# Altium schematic sheet Schematic.SchDoc
size A
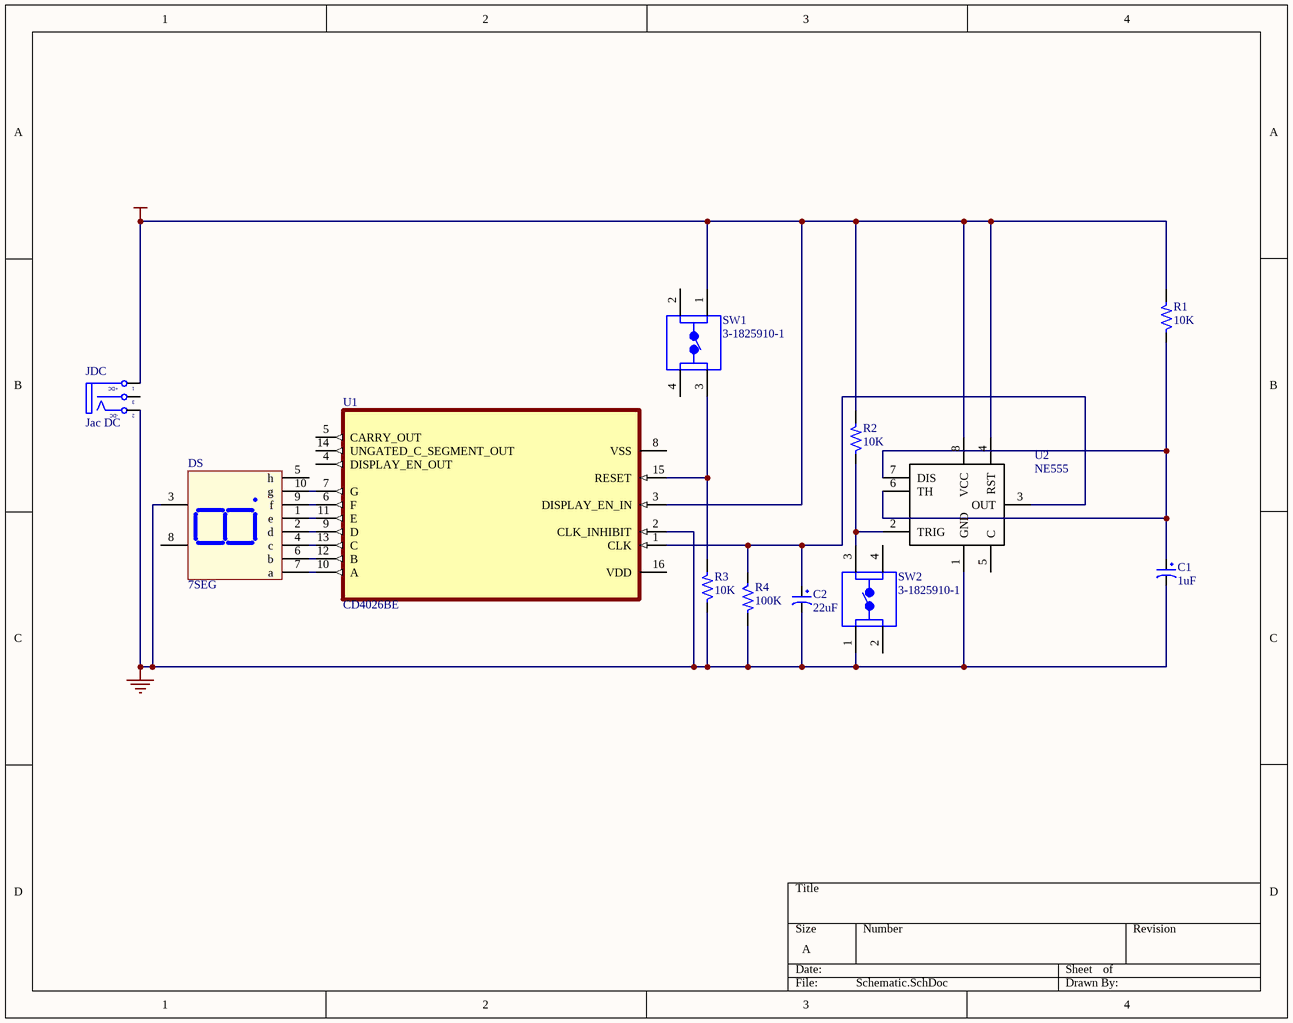
[diagram p0: Schematic.SchDoc]

## Parts
C1  1uF  [CP1/2]
C2  22uF  [CP1/2]
DS  7SEG  [LED7SEG-1-0.56]
JDC  Jac DC  [DC0]
R1  10K  [R1/4W]
R2  10K  [R1/4W]
R3  10K  [R1/4W]
R4  100K  [R1/4W]
SW1  3-1825910-1  [TE_3-1825910-1]
SW2  3-1825910-1  [TE_3-1825910-1]
U1  CD4026BE  [DIP254P762X508-16]
U2  NE555  [DIP8]

## Nets
+5: JDC.1(T) R1.2 R2.2 SW1.1 U1.3(DISPLAY_EN_IN) U2.4(RST) U2.8(VCC)
GND: C1.2 C2.2 DS.3(Vcc) JDC.2(TN) R3.1 R4.2 SW2.1 U1.2(CLK_INHIBIT) U2.1(GND)
NetC1_1: C1.1 R1.1 U2.6(TH) U2.7(DIS)
NetC2_1: C2.1 R4.1 U1.1(CLK) U2.3(OUT)
NetDS_1: DS.1(e) U1.11(E)
NetDS_2: DS.2(d) U1.9(D)
NetDS_4: DS.4(c) U1.13(C)
NetDS_6: DS.6(b) U1.12(B)
NetDS_7: DS.7(a) U1.10(A)
NetDS_9: DS.9(f) U1.6(F)
NetDS_10: DS.10(g) U1.7(G)
NetR2_1: R2.1 SW2.3 U2.2(TRIG)
NetR3_2: R3.2 SW1.3 U1.15(RESET)

Not connected (* = marked no-connect by the designer): DS 5(h) 8(Vcc); JDC 3(S); SW1 2 4; SW2 2 4; U1 4(DISPLAY_EN_OUT) 5(CARRY_OUT) 8(VSS) 14(UNGATED_C_SEGMENT_OUT) 16(VDD); U2 5(C)

## Notes on the sheet
- (in symbol DCIN) +DC; -DC

## Library data of the parts
C1 C2 = CP1: Cap P  0,1uF < 22uF , 16 - 50V; Value: 10uF/50V; Description 1: 10 => 220uF/6,3V/10V - 10uF => 100uF/16V; Description 2: 0,1uF => 33uF/50V - 10uF => 22uF/63V; Description 3: 0,47uF => 10uF/100V
DS = LED7SEG-1: 14.2 mm General Purpose Blue 7-Segment Display: CC, RH DP, Gray Surface; MinimumIntensity: 2020 ucd; Note: IF = 10 mA; Published: 8-Jun-2000; LatestRevisionDate: 17-Dec-2003; LatestRevisionNote: Schematic revised, PCB Footprint replaced.; DatasheetDocument: 24-Sep-2002; PackageDocument: 24-Sep-2002; PackageReference: H; Publisher: Altium Limited; Colour: Blue; ComponentLink1Description: Manufacturer Link; ComponentLink1URL: http://www.agilent.com/
JDC = DCIN: Jac DC input; Value: Jac DC
R1-R4 = R: Resistor 1/4W; Value: R1/4W - 1K
SW1 SW2 = 3-1825910-1: Switch Push Button OFF _ON_ SPST Round Button 0.05A 24VDC Momentary Contact PC Pins Thru-Hole; MF: TE Connectivity; Availability: Unavailable; SnapEDA_Link: https://www.snapeda.com/parts/3-1825910-1/TE%20Connectivity%20ALCOSWITCH%20Switches/view-part/452461/?ref=snap; Price: None; EU_RoHS_Compliance: Compliant; Package: None; TE_purchase_URL: https://www.te.com/usa-en/product-3-1825910-1.html?te_bu=Cor&te_type=disp&te_campaign=seda_glo_cor-seda-global-disp-prtnr-fy19-seda-model-bom-cta_sma-317_1&elqCampaignId=32493; MP: 3-1825910-1; Value: *
U1 = CD4026BE: Counter IC Counter, Decade 1 Element 5 Bit Positive Edge 16-PDIP; MF: Texas Instruments; Package: PDIP-16 Harris; Value: *; Price: None; MP: CD4026BE; Availability: Unavailable; SnapEDA_Link: https://www.snapeda.com/parts/CD4026BE/Texas%20Instruments/view-part/779031/?ref=snap
U2 = NE555: TIMER IC; Manufacturer Part Number: NE555DT; Manufacturer: STMicroelectronics; Frequency: 500kHz; Voltage - Supply: 4.5 V ~ 16 V; Current: 200mA; Supplier 1: Digi-Key; Supplier Part Number 1: 497-1962-2-ND; Supplier: Digi-Key; Category: Integrated Circuits (ICs); Supplier Part Number: 497-1962-2-ND; Package / Case: 8-SOIC (3.9mm Width); Packaging: Tape & Reel (TR); RoHS: RoHS Compliant; Operating Temperature: 0°C ~ 70°C; Count: -; Type: 555 Type, Timer/Oscillator (Single)